# Altium schematic sheet Page G_ZLG_3G.SchDoc
size A3; SheetNumber: 0; SheetTotal: 0
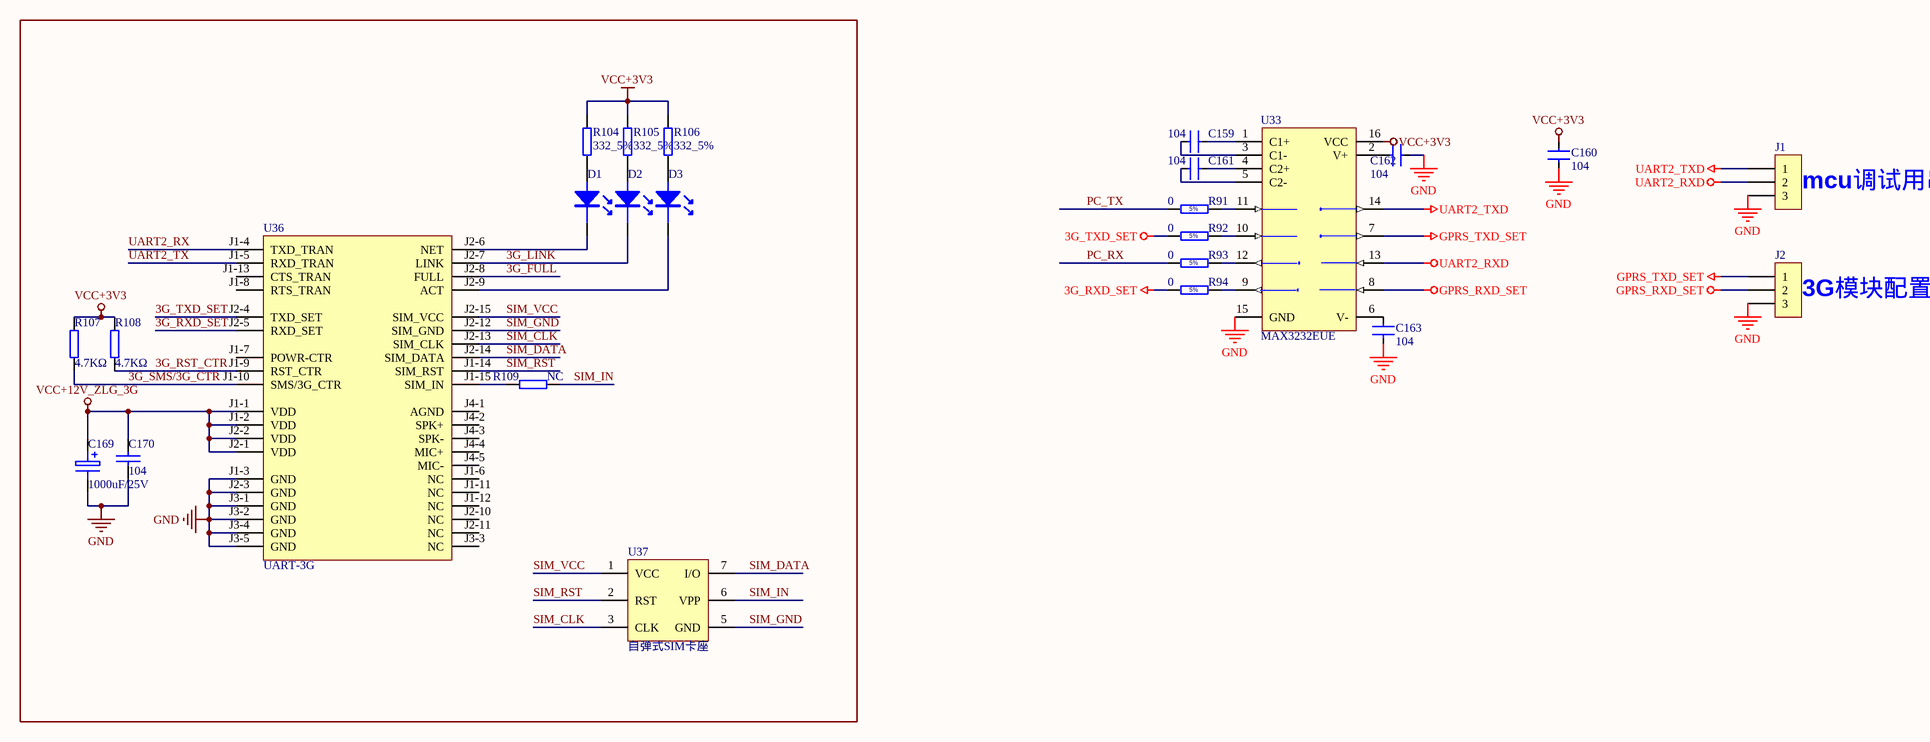
[diagram p0: Page G_ZLG_3G.SchDoc]

## Parts
C159  104  [0603C]
C160  104  [0603C]
C161  104  [0603C]
C162  104  [0603C]
C163  104  [0603C]
C169  1000uF/25V  [C_10_10MM]
C170  104  [0805C]
D1  LED  [LED_3MM]  (value not drawn)
D2  LED  [LED_3MM]  (value not drawn)
D3  LED  [LED_3MM]  (value not drawn)
J1  (no value)  [CHAZUO3*2.54]
J2  (no value)  [CHAZUO3*2.54]
R91  0  [0603R]
R92  0  [0603R]
R93  0  [0603R]
R94  0  [0603R]
R104  332_5%  [0603R]
R105  332_5%  [0603R]
R106  332_5%  [0603R]
R107  4.7KΩ  [0603R]
R108  4.7KΩ  [0603R]
R109  NC  [0603R]
U33  MAX3232EUE  [TSSOP16]
U36  UART-3G  [ZWD_35DP_UART-3G]
U37  自弹式SIM卡座  [SIM_PUSH]

## Nets
3G_RXD_SET: R94.1 U36.J2-5(RXD_SET)
3G_TXD_SET: R92.1 U36.J2-4(TXD_SET)
GND: C160.1 C162.2 C163.2 C169.2 C170.2 J1.3 J2.3 U33.15(GND) U36.J1-3(GND) U36.J2-3(GND) U36.J3-1(GND) U36.J3-2(GND) U36.J3-4(GND) U36.J3-5(GND)
GPRS_RXD_SET: J2.2 U33.8(R2IN)
GPRS_TXD_SET: J2.1 U33.7(T2OUT)
UART2_RXD: J1.2 U33.13(R1IN)
UART2_TXD: J1.1 U33.14(T1OUT)
VCC+3V3: C160.2 R104.1 R105.1 R106.1 R107.1 R108.1 U33.16(VCC)
VCC+12V_ZLG_3G: C169.1 C170.1 U36.J1-1(VDD) U36.J1-2(VDD) U36.J2-1(VDD) U36.J2-2(VDD)
3G_FULL: U36.J2-8(FULL)
3G_LINK: D2.K U36.J2-7(LINK)
3G_RST_CTR: R108.2 U36.J1-9(RST_CTR)
3G_SMS/3G_CTR: R107.2 U36.J1-10(SMS/3G_CTR)
PC_RX: R93.1
PC_TX: R91.1
SIM_CLK: U36.J2-13(SIM_CLK) U37.3(CLK)
SIM_DATA: U36.J2-14(SIM_DATA) U37.7(I/O)
SIM_GND: U36.J2-12(SIM_GND) U37.5(GND)
SIM_IN: R109.2 U37.6(VPP)
SIM_RST: U36.J1-14(SIM_RST) U37.2(RST)
SIM_VCC: U36.J2-15(SIM_VCC) U37.1(VCC)
UART2_RX: U36.J1-4(TXD_TRAN)
UART2_TX: U36.J1-5(RXD_TRAN)
NetC159_1: C159.1 U33.1(C1+)
NetC159_2: C159.2 U33.3(C1-)
NetC161_1: C161.1 U33.4(C2+)
NetC161_2: C161.2 U33.5(C2-)
NetC162_1: C162.1 U33.2(V+)
NetC163_1: C163.1 U33.6(V-)
NetD1_A: D1.A R104.2
NetD1_K: D1.K U36.J2-6(NET)
NetD2_A: D2.A R105.2
NetD3_A: D3.A R106.2
NetD3_K: D3.K U36.J2-9(ACT)
NetR91_2: R91.2 U33.11(T1IN)
NetR92_2: R92.2 U33.10(T2IN)
NetR93_2: R93.2 U33.12(R1OUT)
NetR94_2: R94.2 U33.9(R2OUT)
NetR109_1: R109.1 U36.J1-15(SIM_IN)

Not connected (* = marked no-connect by the designer): U36 J1-6(NC) J1-7(POWR-CTR) J1-8(RTS_TRAN) J1-11(NC) J1-12(NC) J1-13(CTS_TRAN) J2-10(NC) J2-11(NC) J3-3(NC) J4-1(AGND) J4-2(SPK+) J4-3(SPK-) J4-4(MIC+) J4-5(MIC-)

## Notes on the sheet
- (near J1) mcu调试用串口
- (near J2) 3G模块配置串口
- (in symbol Resistor - 5%) 5%

## Library data of the parts
C159-C163 = C-X5R/X7R
C169 = 1000uF/25V: CD11
C170 = 0.1uF: CC; Value: 10uf
J1 J2 = SIP3-2.54: CN-SIP3-2.54
R91-R94 = Resistor - 5%
R104-R106 = R-0805R
R107-R109 = 1K-0805R: Value: 1K
U33 = MAX3232EUE: 3.0V TO 5.5V, Low-Power, up to 1Mbps, True RS-232 Transceiver Using Four 0.1礔 External Capacitor; Published: 16-Jan-2001; LatestRevisionDate: 06-Jun-2005; LatestRevisionNote: Stylized 3D Model Added.; DatasheetVersion: Mar-1999; PackageVersion: 21-0066 C; PackageReference: TSSOP16; Publisher: Altium Limited; PackageDescription: Shrink Small Outline; 16 Leads; Body Width 4.4 mm; Pitch 0.65 mm; ComponentLink1Description: Manufacturer Link; ComponentLink1URL: http://www.maxim-ic.com/; ComponentLink2Description: Datasheet; ComponentLink2URL: http://pdfserv.maxim-ic.com/en/ds/MAX3222-MAX3241.pdf
U36 = ZWD-35DP-UART-3G
U37 = SIM_PUSH